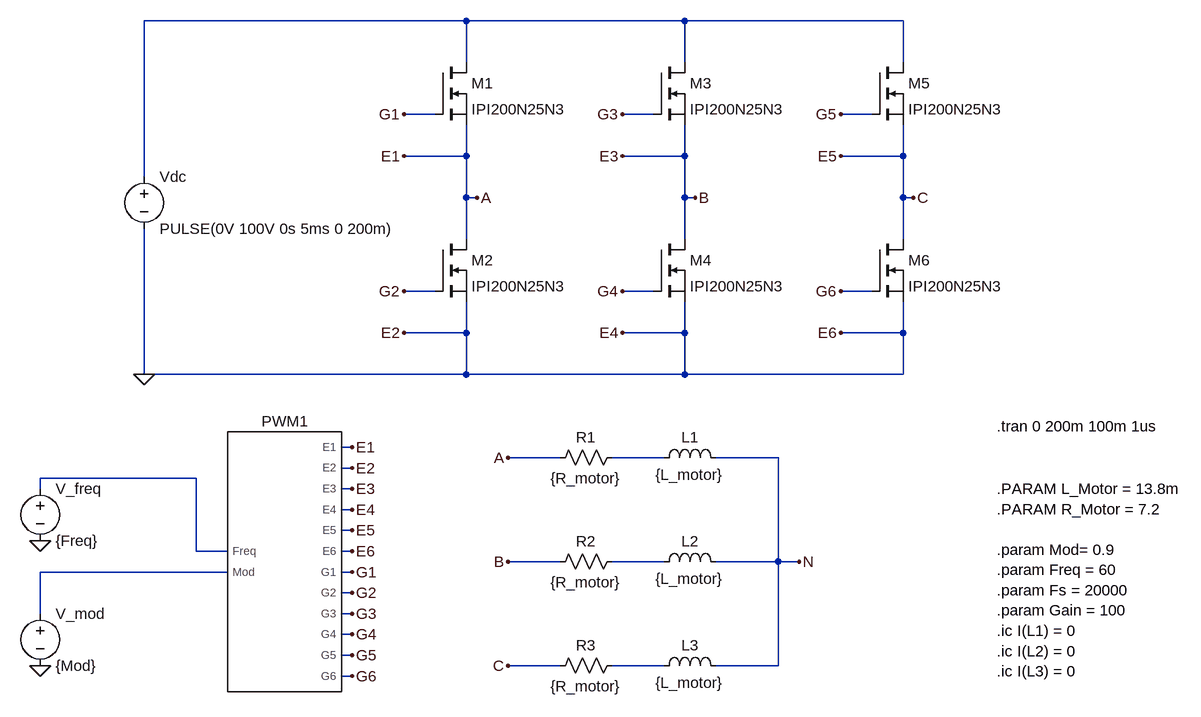
[diagram p0: schematic Trefas_med_modul.asc]
Trefas_med_modul.asc, the LTspice schematic file:
Version 4
SHEET 1 2100 680
WIRE 576 -800 80 -800
WIRE 912 -800 576 -800
WIRE 1248 -800 912 -800
WIRE 576 -736 576 -800
WIRE 912 -736 912 -800
WIRE 1248 -736 1248 -800
WIRE 528 -656 480 -656
WIRE 864 -656 816 -656
WIRE 1200 -656 1152 -656
WIRE 576 -592 576 -640
WIRE 576 -592 480 -592
WIRE 912 -592 912 -640
WIRE 912 -592 816 -592
WIRE 1248 -592 1248 -640
WIRE 1248 -592 1152 -592
WIRE 80 -560 80 -800
WIRE 576 -528 576 -592
WIRE 592 -528 576 -528
WIRE 912 -528 912 -592
WIRE 928 -528 912 -528
WIRE 1248 -528 1248 -592
WIRE 1264 -528 1248 -528
WIRE 576 -464 576 -528
WIRE 912 -464 912 -528
WIRE 1248 -464 1248 -528
WIRE 528 -384 480 -384
WIRE 864 -384 816 -384
WIRE 1200 -384 1152 -384
WIRE 576 -320 576 -368
WIRE 576 -320 480 -320
WIRE 912 -320 912 -368
WIRE 912 -320 816 -320
WIRE 1248 -320 1248 -368
WIRE 1248 -320 1152 -320
WIRE 80 -256 80 -480
WIRE 576 -256 576 -320
WIRE 576 -256 80 -256
WIRE 912 -256 912 -320
WIRE 912 -256 576 -256
WIRE 1248 -256 1248 -320
WIRE 1248 -256 912 -256
WIRE 400 -144 384 -144
WIRE 720 -128 640 -128
WIRE 880 -128 800 -128
WIRE 1056 -128 960 -128
WIRE 400 -112 384 -112
WIRE 160 -96 -80 -96
WIRE -80 -80 -80 -96
WIRE 400 -80 384 -80
WIRE 400 -48 384 -48
WIRE 400 -16 384 -16
WIRE 160 16 160 -96
WIRE 208 16 160 16
WIRE 400 16 384 16
WIRE 720 32 640 32
WIRE 880 32 800 32
WIRE 1056 32 1056 -128
WIRE 1056 32 960 32
WIRE 1088 32 1056 32
WIRE 208 48 -80 48
WIRE 400 48 384 48
WIRE 400 80 384 80
WIRE -80 112 -80 48
WIRE 400 112 384 112
WIRE 400 144 384 144
WIRE 400 176 384 176
WIRE 720 192 640 192
WIRE 880 192 800 192
WIRE 1056 192 1056 32
WIRE 1056 192 960 192
WIRE 400 208 384 208
FLAG -80 0 0
FLAG -80 192 0
FLAG 480 -656 G1
FLAG 480 -592 E1
FLAG 480 -384 G2
FLAG 480 -320 E2
FLAG 816 -656 G3
FLAG 816 -592 E3
FLAG 816 -384 G4
FLAG 816 -320 E4
FLAG 1152 -656 G5
FLAG 1152 -592 E5
FLAG 1152 -384 G6
FLAG 1152 -320 E6
FLAG 592 -528 A
FLAG 928 -528 B
FLAG 1264 -528 C
FLAG 400 -144 E1
FLAG 400 -112 E2
FLAG 400 -80 E3
FLAG 400 -48 E4
FLAG 400 -16 E5
FLAG 400 16 E6
FLAG 400 48 G1
FLAG 400 80 G2
FLAG 400 112 G3
FLAG 400 144 G4
FLAG 400 176 G5
FLAG 400 208 G6
FLAG 640 -128 A
FLAG 640 32 B
FLAG 640 192 C
FLAG 1088 32 N
FLAG 80 -256 0
SYMBOL voltage -80 96 R0
SYMATTR InstName V_mod
SYMATTR Value {Mod}
SYMBOL voltage -80 -96 R0
SYMATTR InstName V_freq
SYMATTR Value {Freq}
SYMBOL voltage 80 -576 R0
WINDOW 123 0 0 Left 0
WINDOW 39 0 0 Left 0
SYMATTR InstName Vdc
SYMATTR Value PULSE(0V 100V 0s 5ms 0 200m)
SYMBOL nmos 528 -736 R0
SYMATTR InstName M1
SYMATTR Value IPI200N25N3
SYMBOL nmos 528 -464 R0
SYMATTR InstName M2
SYMATTR Value IPI200N25N3
SYMBOL nmos 864 -736 R0
SYMATTR InstName M3
SYMATTR Value IPI200N25N3
SYMBOL nmos 864 -464 R0
SYMATTR InstName M4
SYMATTR Value IPI200N25N3
SYMBOL nmos 1200 -736 R0
SYMATTR InstName M5
SYMATTR Value IPI200N25N3
SYMBOL nmos 1200 -464 R0
SYMATTR InstName M6
SYMATTR Value IPI200N25N3
SYMBOL res 704 -112 R270
WINDOW 0 32 56 VTop 2
WINDOW 3 0 56 VBottom 2
SYMATTR InstName R1
SYMATTR Value {R_motor}
SYMBOL ind 864 -112 R270
WINDOW 0 32 56 VTop 2
WINDOW 3 5 56 VBottom 2
SYMATTR InstName L1
SYMATTR Value {L_motor}
SYMATTR SpiceLine Rser=0.02
SYMBOL res 704 48 R270
WINDOW 0 32 56 VTop 2
WINDOW 3 0 56 VBottom 2
SYMATTR InstName R2
SYMATTR Value {R_motor}
SYMBOL ind 864 48 R270
WINDOW 0 32 56 VTop 2
WINDOW 3 5 56 VBottom 2
SYMATTR InstName L2
SYMATTR Value {L_motor}
SYMATTR SpiceLine Rser=0.02
SYMBOL res 704 208 R270
WINDOW 0 32 56 VTop 2
WINDOW 3 0 56 VBottom 2
SYMATTR InstName R3
SYMATTR Value {R_motor}
SYMBOL ind 864 208 R270
WINDOW 0 32 56 VTop 2
WINDOW 3 5 56 VBottom 2
SYMATTR InstName L3
SYMATTR Value {L_motor}
SYMATTR SpiceLine Rser=0.02
SYMBOL Trefas_exempel 320 32 R0
SYMATTR InstName PWM1
TEXT 1392 -176 Left 2 !.tran 0 200m 100m 1us
TEXT 1392 -80 Left 2 !.PARAM L_Motor = 13.8m\n.PARAM R_Motor = 7.2\n \n.param Mod= 0.9\n.param Freq = 60\n.param Fs = 20000\n.param Gain = 100\n.ic I(L1) = 0\n.ic I(L2) = 0\n.ic I(L3) = 0

The netlist it stands for:
* Trefas_med_modul.asc
V_mod N005 0 {Mod}
V_freq N003 0 {Freq}
Vdc N001 0 PULSE(0V 100V 0s 5ms 0 200m)
M1 N001 G1 A A IPI200N25N3
M2 A G2 0 0 IPI200N25N3
M3 N001 G3 B B IPI200N25N3
M4 B G4 0 0 IPI200N25N3
M5 N001 G5 C C IPI200N25N3
M6 C G6 0 0 IPI200N25N3
R1 A N002 {R_motor}
L1 N002 N {L_motor} Rser=0.02
R2 B N004 {R_motor}
L2 N004 N {L_motor} Rser=0.02
R3 C N006 {R_motor}
L3 N006 N {L_motor} Rser=0.02
XPWM1 N003 N005 A 0 B 0 C 0 G1 G2 G3 G4 G5 G6 Trefas_exempel  ; pins Freq Mod E1 E2 E3 E4 E5 E6 G1 G2 G3 G4 G5 G6
.model NMOS NMOS
.model PMOS PMOS
.lib standard.mos
.tran 0 200m 100m 1us
.PARAM L_Motor = 13.8m
.PARAM R_Motor = 7.2
.param Mod= 0.9
.param Freq = 60
.param Fs = 20000
.param Gain = 100
.ic I(L1) = 0
.ic I(L2) = 0
.ic I(L3) = 0
.backanno
.end